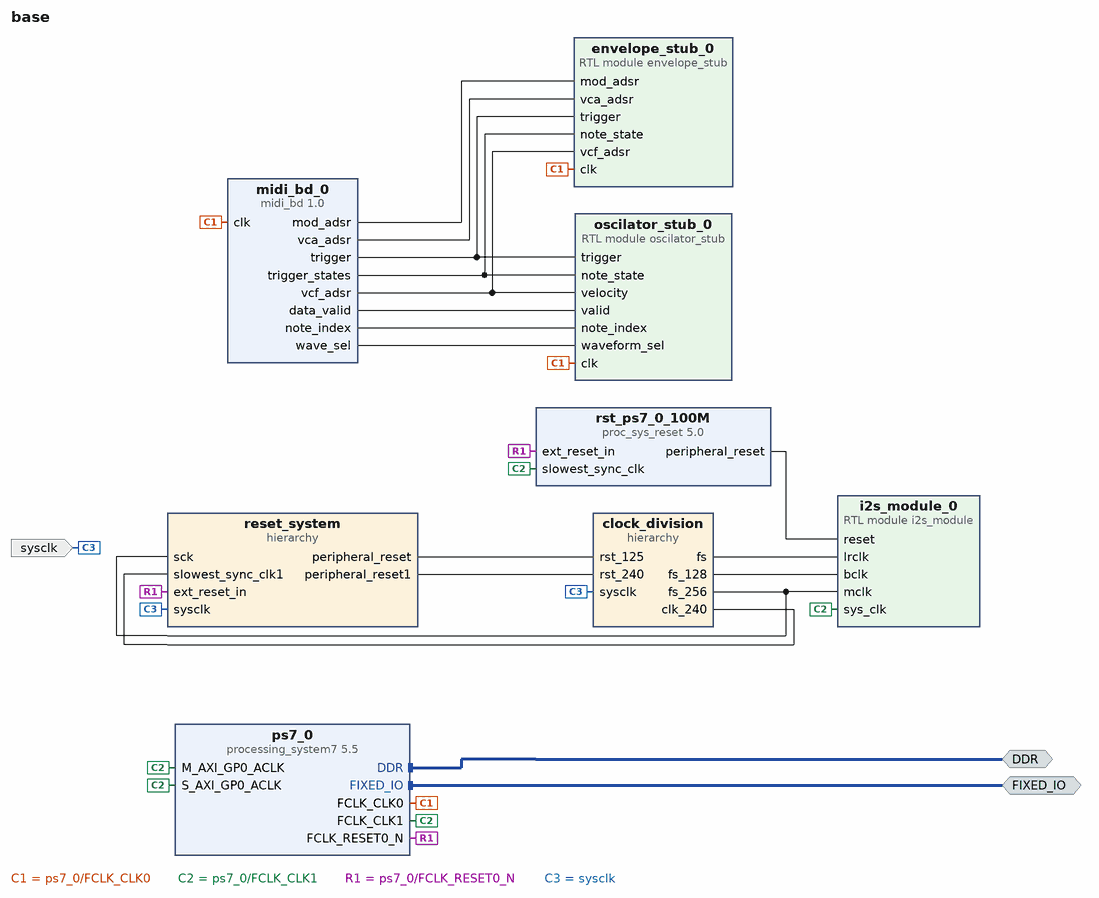
[diagram p0: block diagram of the top level]
# Vivado block design base, xc7z020clg400-1, Vivado 2021.1
create_bd_design base

create_bd_intf_port -mode Master -vlnv xilinx.com:interface:ddrx_rtl:1.0 DDR
create_bd_intf_port -mode Master -vlnv xilinx.com:display_processing_system7:fixedio_rtl:1.0 FIXED_IO
create_bd_port -dir I -type clk sysclk
set_property -dict {CONFIG.FREQ_HZ 125000000} [get_bd_ports sysclk]

create_bd_cell -type ip -vlnv xilinx.com:ip:processing_system7:5.5 ps7_0
set_property -dict [list \
  CONFIG.PCW_APU_PERIPHERAL_FREQMHZ 650 \
  CONFIG.PCW_CRYSTAL_PERIPHERAL_FREQMHZ 50 \
  CONFIG.PCW_ENET0_ENET0_IO {MIO 16 .. 27} \
  CONFIG.PCW_ENET0_GRP_MDIO_ENABLE 1 \
  CONFIG.PCW_ENET0_GRP_MDIO_IO {MIO 52 .. 53} \
  CONFIG.PCW_ENET0_PERIPHERAL_ENABLE 1 \
  CONFIG.PCW_EN_CLK1_PORT 1 \
  CONFIG.PCW_FCLK_CLK1_BUF TRUE \
  CONFIG.PCW_FPGA0_PERIPHERAL_FREQMHZ 100 \
  CONFIG.PCW_FPGA1_PERIPHERAL_FREQMHZ 100 \
  CONFIG.PCW_FPGA2_PERIPHERAL_FREQMHZ 200 \
  CONFIG.PCW_FPGA3_PERIPHERAL_FREQMHZ 100 \
  CONFIG.PCW_FPGA_FCLK1_ENABLE 1 \
  CONFIG.PCW_GPIO_MIO_GPIO_ENABLE 0 \
  CONFIG.PCW_I2C_PERIPHERAL_FREQMHZ 108.333336 \
  CONFIG.PCW_IRQ_F2P_INTR 1 \
  CONFIG.PCW_PERIPHERAL_BOARD_PRESET None \
  CONFIG.PCW_PRESET_BANK1_VOLTAGE {LVCMOS 1.8V} \
  CONFIG.PCW_QSPI_GRP_FBCLK_ENABLE 1 \
  CONFIG.PCW_QSPI_GRP_FBCLK_IO {MIO 8} \
  CONFIG.PCW_QSPI_GRP_SINGLE_SS_ENABLE 1 \
  CONFIG.PCW_QSPI_GRP_SINGLE_SS_IO {MIO 1 .. 6} \
  CONFIG.PCW_QSPI_PERIPHERAL_ENABLE 1 \
  CONFIG.PCW_QSPI_QSPI_IO {MIO 1 .. 6} \
  CONFIG.PCW_SD0_GRP_CD_ENABLE 1 \
  CONFIG.PCW_SD0_GRP_CD_IO {MIO 47} \
  CONFIG.PCW_SD0_GRP_WP_ENABLE 0 \
  CONFIG.PCW_SD0_PERIPHERAL_ENABLE 1 \
  CONFIG.PCW_SD0_SD0_IO {MIO 40 .. 45} \
  CONFIG.PCW_SDIO_PERIPHERAL_FREQMHZ 50 \
  CONFIG.PCW_SINGLE_QSPI_DATA_MODE x4 \
  CONFIG.PCW_UART0_PERIPHERAL_ENABLE 1 \
  CONFIG.PCW_UART0_UART0_IO {MIO 14 .. 15} \
  CONFIG.PCW_UART1_PERIPHERAL_ENABLE 0 \
  CONFIG.PCW_UART_PERIPHERAL_FREQMHZ 100 \
  CONFIG.PCW_UIPARAM_DDR_BUS_WIDTH {16 Bit} \
  CONFIG.PCW_UIPARAM_DDR_FREQ_MHZ 525 \
  CONFIG.PCW_UIPARAM_DDR_PARTNO Custom \
  CONFIG.PCW_USB0_PERIPHERAL_ENABLE 1 \
  CONFIG.PCW_USB0_USB0_IO {MIO 28 .. 39} \
  CONFIG.PCW_USE_FABRIC_INTERRUPT 1 \
  CONFIG.PCW_USE_S_AXI_GP0 1 \
] [get_bd_cells ps7_0]
# 477 more settings of ps7_0 are not shown: defaults, MIO pin electricals, DDR timing, and values the tool derives
create_bd_cell -type hier clock_division
create_bd_cell -type hier reset_system
create_bd_cell -type module -reference oscilator_stub oscilator_stub_0
create_bd_cell -type ip -vlnv xilinx.com:ip:proc_sys_reset:5.0 rst_ps7_0_100M
create_bd_cell -type module -reference envelope_stub envelope_stub_0
create_bd_cell -type module -reference i2s_module i2s_module_0
create_bd_cell -type ip -vlnv xilinx.com:user:midi_bd:1.0 midi_bd_0

# ---- hierarchy /clock_division ----
current_bd_instance /clock_division
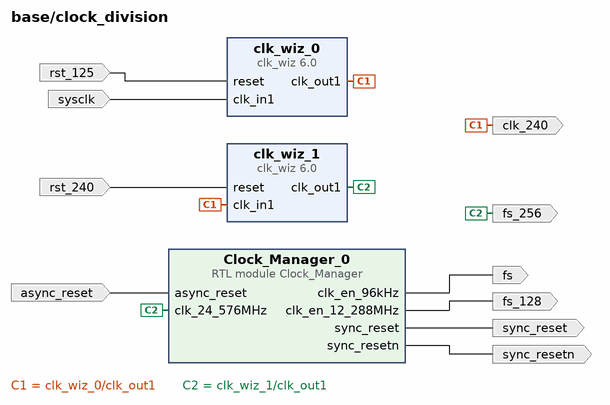
[diagram p1: block diagram inside /clock_division]
create_bd_pin -dir I -type rst rst_125
create_bd_pin -dir O -type clk fs_128
create_bd_pin -dir I -type clk sysclk
create_bd_pin -dir O -type clk fs_256
create_bd_pin -dir O fs
create_bd_pin -dir O -type rst sync_reset
create_bd_pin -dir I -type rst async_reset
create_bd_pin -dir I -type rst rst_240
create_bd_pin -dir O -type clk clk_240
create_bd_pin -dir O -type rst sync_resetn

create_bd_cell -type ip -vlnv xilinx.com:ip:clk_wiz:6.0 clk_wiz_0
set_property -dict [list \
  CONFIG.CLKIN1_JITTER_PS 80.0 \
  CONFIG.CLKOUT1_DRIVES BUFG \
  CONFIG.CLKOUT1_JITTER 153.863 \
  CONFIG.CLKOUT1_PHASE_ERROR 561.711 \
  CONFIG.CLKOUT1_REQUESTED_OUT_FREQ 240 \
  CONFIG.CLKOUT2_DRIVES BUFG \
  CONFIG.CLKOUT3_DRIVES BUFG \
  CONFIG.CLKOUT4_DRIVES BUFG \
  CONFIG.CLKOUT5_DRIVES BUFG \
  CONFIG.CLKOUT6_DRIVES BUFG \
  CONFIG.CLKOUT7_DRIVES BUFG \
  CONFIG.JITTER_SEL Max_I_Jitter \
  CONFIG.MMCM_BANDWIDTH LOW \
  CONFIG.MMCM_CLKFBOUT_MULT_F 48 \
  CONFIG.MMCM_CLKIN1_PERIOD 8.000 \
  CONFIG.MMCM_CLKOUT0_DIVIDE_F 5 \
  CONFIG.MMCM_COMPENSATION ZHOLD \
  CONFIG.MMCM_DIVCLK_DIVIDE 5 \
  CONFIG.PLL_CLKIN_PERIOD 8.000 \
  CONFIG.PRIMITIVE PLL \
  CONFIG.PRIM_IN_FREQ 125 \
] [get_bd_cells clk_wiz_0]
create_bd_cell -type ip -vlnv xilinx.com:ip:clk_wiz:6.0 clk_wiz_1
set_property -dict [list \
  CONFIG.CLKIN1_JITTER_PS 41.660000000000004 \
  CONFIG.CLKIN2_JITTER_PS 79.99 \
  CONFIG.CLKOUT1_JITTER 135.770 \
  CONFIG.CLKOUT1_PHASE_ERROR 78.883 \
  CONFIG.CLKOUT1_REQUESTED_OUT_FREQ 24.576 \
  CONFIG.JITTER_SEL Min_O_Jitter \
  CONFIG.MMCM_BANDWIDTH HIGH \
  CONFIG.MMCM_CLKFBOUT_MULT_F 4.875 \
  CONFIG.MMCM_CLKIN1_PERIOD 4.167 \
  CONFIG.MMCM_CLKIN2_PERIOD 10.0 \
  CONFIG.MMCM_CLKOUT0_DIVIDE_F 47.625 \
  CONFIG.MMCM_DIVCLK_DIVIDE 1 \
  CONFIG.PRIM_IN_FREQ 240.000 \
  CONFIG.PRIM_SOURCE Single_ended_clock_capable_pin \
  CONFIG.SECONDARY_IN_FREQ 100.000 \
  CONFIG.SECONDARY_SOURCE Single_ended_clock_capable_pin \
  CONFIG.USE_INCLK_SWITCHOVER false \
] [get_bd_cells clk_wiz_1]
create_bd_cell -type module -reference Clock_Manager Clock_Manager_0

# ---- hierarchy /reset_system ----
current_bd_instance /reset_system
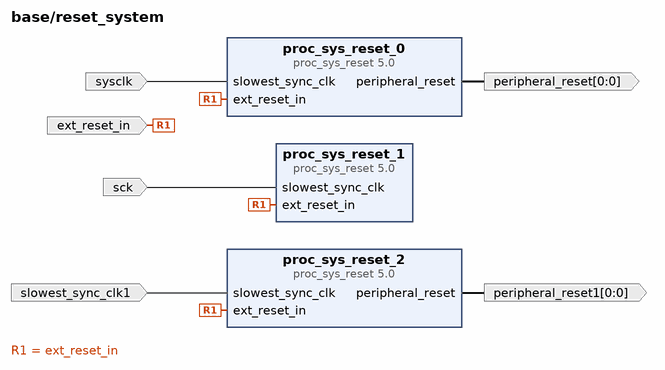
[diagram p2: block diagram inside /reset_system]
create_bd_pin -dir I -type clk sysclk
create_bd_pin -dir I -type rst ext_reset_in
create_bd_pin -dir O -from 0 -to 0 -type rst peripheral_reset
create_bd_pin -dir I -type clk slowest_sync_clk1
create_bd_pin -dir O -from 0 -to 0 -type rst peripheral_reset1
create_bd_pin -dir I -type clk sck

create_bd_cell -type ip -vlnv xilinx.com:ip:proc_sys_reset:5.0 proc_sys_reset_0
set_property -dict {CONFIG.C_NUM_PERP_ARESETN 1} [get_bd_cells proc_sys_reset_0]
create_bd_cell -type ip -vlnv xilinx.com:ip:proc_sys_reset:5.0 proc_sys_reset_2
create_bd_cell -type ip -vlnv xilinx.com:ip:proc_sys_reset:5.0 proc_sys_reset_1

# ---- connections ----

current_bd_instance /clock_division
connect_bd_net [get_bd_pins Clock_Manager_0/clk_en_12_288MHz] [get_bd_pins fs_128]
connect_bd_net [get_bd_pins Clock_Manager_0/clk_en_96kHz] [get_bd_pins fs]
connect_bd_net [get_bd_pins Clock_Manager_0/sync_reset] [get_bd_pins sync_reset]
connect_bd_net [get_bd_pins Clock_Manager_0/sync_resetn] [get_bd_pins sync_resetn]
connect_bd_net [get_bd_pins async_reset] [get_bd_pins Clock_Manager_0/async_reset]
connect_bd_net [get_bd_pins clk_wiz_0/clk_out1] [get_bd_pins clk_wiz_1/clk_in1] [get_bd_pins clk_240]
connect_bd_net [get_bd_pins clk_wiz_1/clk_out1] [get_bd_pins fs_256] [get_bd_pins Clock_Manager_0/clk_24_576MHz]
connect_bd_net -net proc_sys_reset_0_peripheral_reset [get_bd_pins rst_125] [get_bd_pins clk_wiz_0/reset]
connect_bd_net -net rst_240_1 [get_bd_pins rst_240] [get_bd_pins clk_wiz_1/reset]
connect_bd_net [get_bd_pins sysclk] [get_bd_pins clk_wiz_0/clk_in1]

current_bd_instance /reset_system
connect_bd_net -net clk_wiz_2_clk_out1 [get_bd_pins sck] [get_bd_pins proc_sys_reset_1/slowest_sync_clk]
connect_bd_net -net clock_division_clk_out1 [get_bd_pins slowest_sync_clk1] [get_bd_pins proc_sys_reset_2/slowest_sync_clk]
connect_bd_net [get_bd_pins proc_sys_reset_0/peripheral_reset] [get_bd_pins peripheral_reset]
connect_bd_net [get_bd_pins proc_sys_reset_2/peripheral_reset] [get_bd_pins peripheral_reset1]
connect_bd_net -net ps7_0_FCLK_RESET0_N [get_bd_pins ext_reset_in] \
  [get_bd_pins proc_sys_reset_1/ext_reset_in] [get_bd_pins proc_sys_reset_2/ext_reset_in] \
  [get_bd_pins proc_sys_reset_0/ext_reset_in]
connect_bd_net [get_bd_pins sysclk] [get_bd_pins proc_sys_reset_0/slowest_sync_clk]

current_bd_instance /
connect_bd_intf_net [get_bd_intf_ports DDR] [get_bd_intf_pins ps7_0/DDR]
connect_bd_intf_net [get_bd_intf_ports FIXED_IO] [get_bd_intf_pins ps7_0/FIXED_IO]
connect_bd_net -net clk_wiz_2_clk_out1 [get_bd_pins clock_division/fs_256] [get_bd_pins reset_system/sck] [get_bd_pins i2s_module_0/mclk]
connect_bd_net -net clock_division_clk_out1 [get_bd_pins clock_division/clk_240] [get_bd_pins reset_system/slowest_sync_clk1]
connect_bd_net [get_bd_pins clock_division/fs] [get_bd_pins i2s_module_0/lrclk]
connect_bd_net [get_bd_pins clock_division/fs_128] [get_bd_pins i2s_module_0/bclk]
connect_bd_net [get_bd_pins midi_bd_0/data_valid] [get_bd_pins oscilator_stub_0/valid]
connect_bd_net [get_bd_pins midi_bd_0/mod_adsr] [get_bd_pins envelope_stub_0/mod_adsr]
connect_bd_net [get_bd_pins midi_bd_0/note_index] [get_bd_pins oscilator_stub_0/note_index]
connect_bd_net [get_bd_pins midi_bd_0/trigger] [get_bd_pins oscilator_stub_0/trigger] [get_bd_pins envelope_stub_0/trigger]
connect_bd_net [get_bd_pins midi_bd_0/trigger_states] [get_bd_pins oscilator_stub_0/note_state] [get_bd_pins envelope_stub_0/note_state]
connect_bd_net [get_bd_pins midi_bd_0/vca_adsr] [get_bd_pins envelope_stub_0/vca_adsr]
connect_bd_net [get_bd_pins midi_bd_0/vcf_adsr] [get_bd_pins oscilator_stub_0/velocity] [get_bd_pins envelope_stub_0/vcf_adsr]
connect_bd_net [get_bd_pins midi_bd_0/wave_sel] [get_bd_pins oscilator_stub_0/waveform_sel]
connect_bd_net -net proc_sys_reset_0_peripheral_reset [get_bd_pins reset_system/peripheral_reset] [get_bd_pins clock_division/rst_125]
connect_bd_net -net proc_sys_reset_2_peripheral_reset [get_bd_pins reset_system/peripheral_reset1] [get_bd_pins clock_division/rst_240]
connect_bd_net [get_bd_pins ps7_0/FCLK_CLK0] [get_bd_pins oscilator_stub_0/clk] [get_bd_pins envelope_stub_0/clk] [get_bd_pins midi_bd_0/clk]
connect_bd_net [get_bd_pins ps7_0/FCLK_CLK1] \
  [get_bd_pins ps7_0/M_AXI_GP0_ACLK] [get_bd_pins ps7_0/S_AXI_GP0_ACLK] [get_bd_pins rst_ps7_0_100M/slowest_sync_clk] \
  [get_bd_pins i2s_module_0/sys_clk]
connect_bd_net [get_bd_pins ps7_0/FCLK_RESET0_N] [get_bd_pins reset_system/ext_reset_in] [get_bd_pins rst_ps7_0_100M/ext_reset_in]
connect_bd_net [get_bd_pins rst_ps7_0_100M/peripheral_reset] [get_bd_pins i2s_module_0/reset]
connect_bd_net [get_bd_ports sysclk] [get_bd_pins clock_division/sysclk] [get_bd_pins reset_system/sysclk]
set_property HDL_ATTRIBUTE.BMM_INFO_PROCESSOR {arm > base iop_pmoda/mb_bram_ctrl base iop_pmodb/mb_bram_ctrl base iop_arduino/mb_bram_ctrl} [get_bd_cells ps7_0]
set_property HDL_ATTRIBUTE.KEEP_HIERARCHY yes [get_bd_cells ps7_0]
set_property PFM.AXI_PORT {  S_AXI_ACP {memport "S_AXI_ACP"}  S_AXI_HP1 {memport "S_AXI_HP"}  S_AXI_HP3 {memport "S_AXI_HP"}  } [get_bd_cells ps7_0]
set_property PFM.CLOCK {  FCLK_CLK0 {id "0" is_default "true"  proc_sys_reset "rst_ps7_0_fclk0" status "fixed"}  FCLK_CLK1 {id "1" is_default "false"  proc_sys_reset "rst_ps7_0_fclk1" status "fixed"}  FCLK_CLK3 {id "3" is_default "false"  proc_sys_reset "rst_ps7_0_fclk3" status "fixed"}  } [get_bd_cells ps7_0]

# ---- address map ----
assign_bd_address -offset 0x60000000 -range 512M -target_address_space [get_bd_addr_spaces ps7_0/Data] [get_bd_addr_segs ps7_0/S_AXI_GP0/GP0_M_AXI_GP0]
exclude_bd_addr_seg -offset 0x00000000 -range 1 -target_address_space [get_bd_addr_spaces ps7_0/Data] [get_bd_addr_segs ps7_0/S_AXI_GP0/GP0_DDR_LOWOCM]
exclude_bd_addr_seg -offset 0x00000000 -range 1 -target_address_space [get_bd_addr_spaces ps7_0/Data] [get_bd_addr_segs ps7_0/S_AXI_GP0/GP0_IOP]
exclude_bd_addr_seg -offset 0x00000000 -range 1 -target_address_space [get_bd_addr_spaces ps7_0/Data] [get_bd_addr_segs ps7_0/S_AXI_GP0/GP0_QSPI_LINEAR]

validate_bd_design
save_bd_design
